# EAGLE design 0251 (EAGLE 7.2.0)
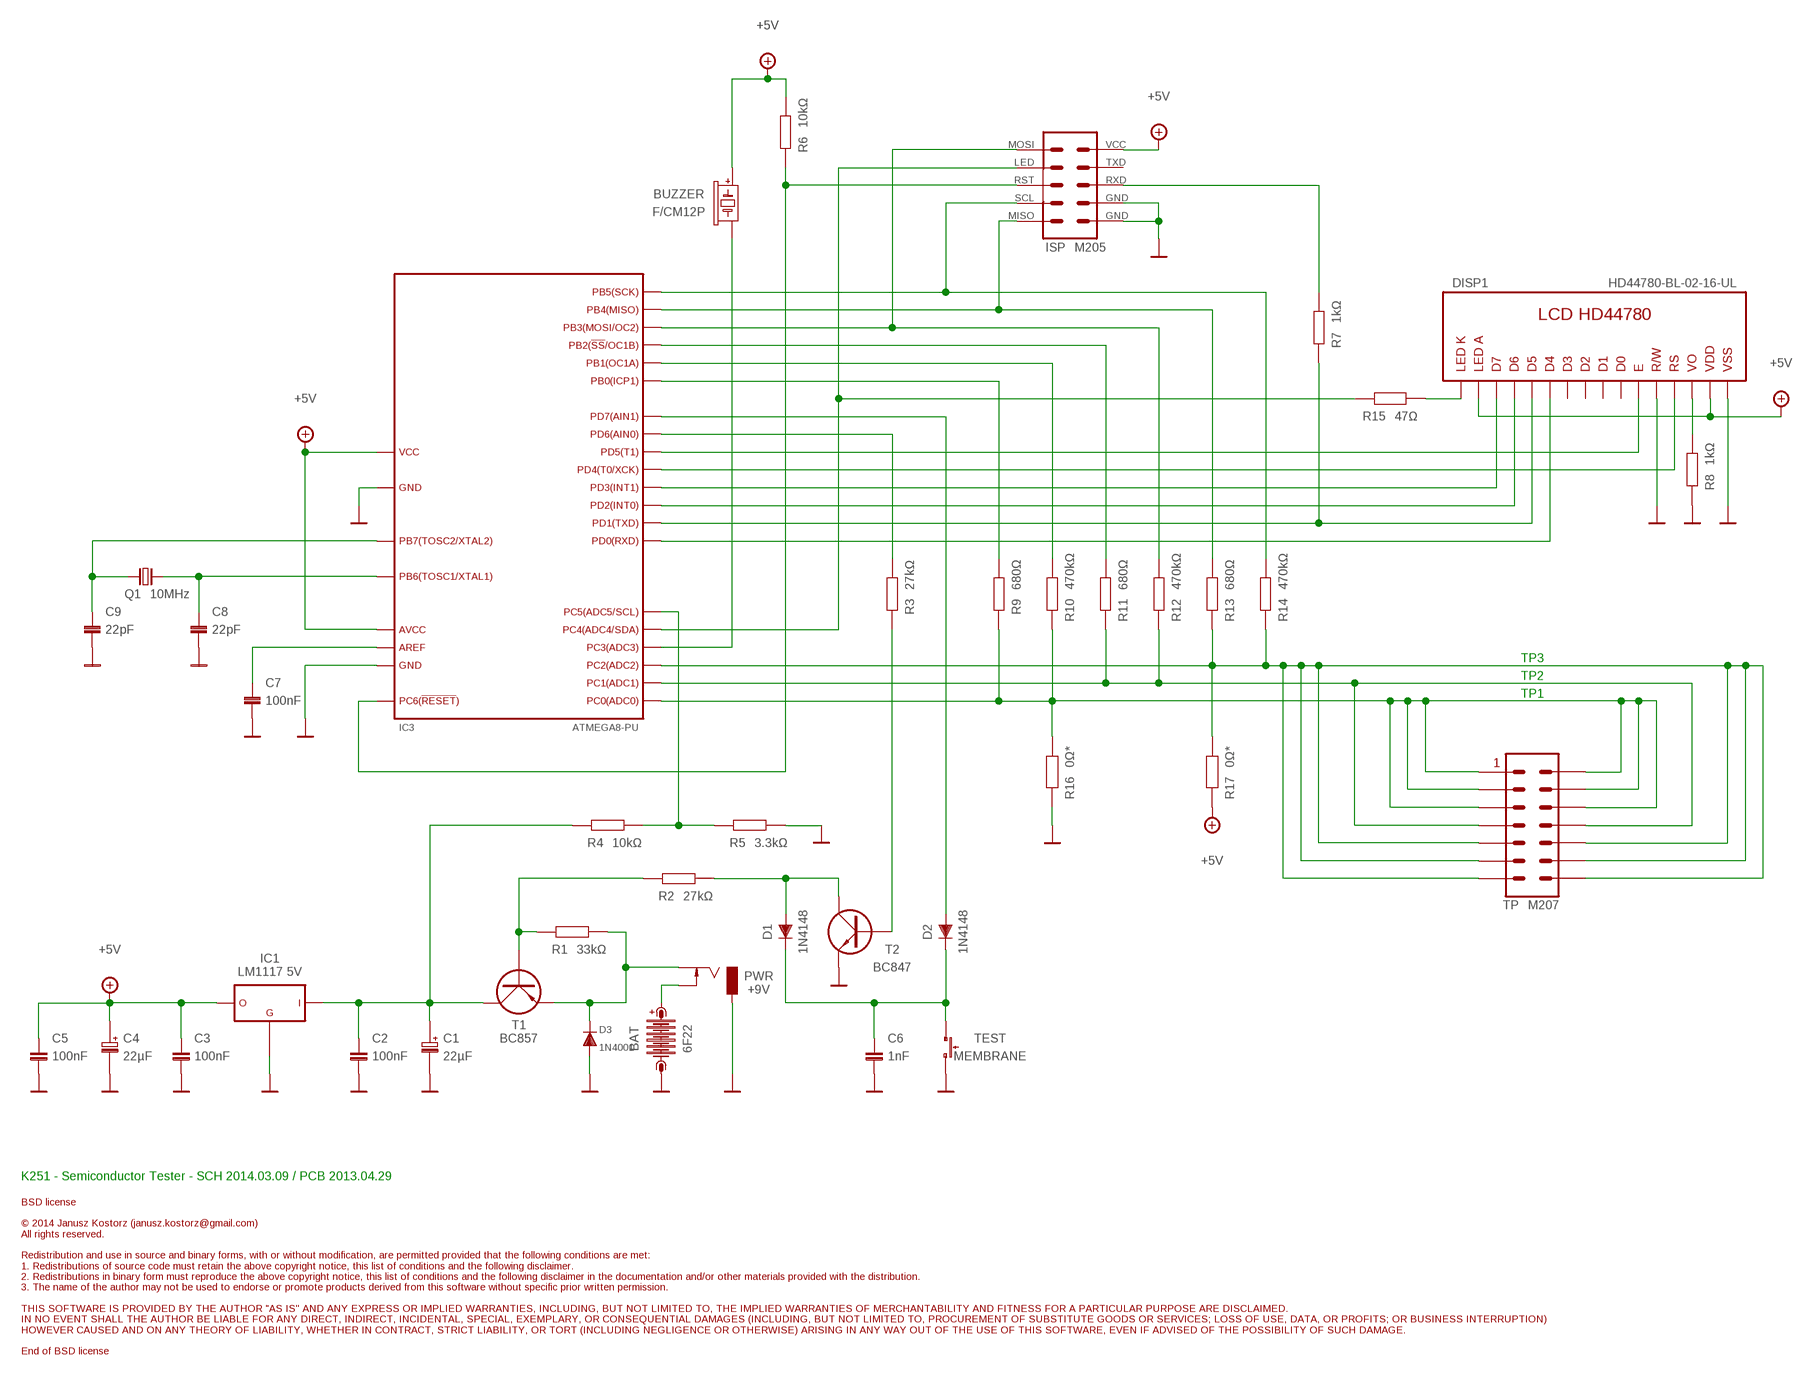
[diagram p0: schematic, sheet 1]

## Parts
BAT  6F22  AB9V  [AB9V]
BUZZER  F/CM12P  BUZZER_F/CM12P  [BUZZER_F/CM12P]
C1  22µF  FM1A101  [E-050-110-020-05]
C2  100nF  CC1206  [C1206]
C3  100nF  CC1206  [C1206]
C4  22µF  FM1A101  [E-050-110-020-05]
C5  100nF  CC1206  [C1206]
C6  1nF  CC1206  [C1206]
C7  100nF  CC1206  [C1206]
C8  22pF  CC1206  [C1206]
C9  22pF  CC1206  [C1206]
D1  1N4148  1N4148DO35-10  [DO35-10]
D2  1N4148  1N4148DO35-10  [DO35-10]
D3  1N4001  1N4004  [DO41-10]
DISP1  HD44780-BL-02-16-UL  [02-16-UL-BL]
IC1  LM1117 5V  LM1117DTX-5.0  [TO252]
IC3  ATMEGA8-PU  [DIP254P800X550-28B]
ISP  M205  ATMEL-ISP-10-UART-H  [MM-10-H]
PWR  +9V  DCJ0303  [DCJ0303]
Q1  10MHz  CRYSTALHC49S  [HC49/S]
R1  33kΩ  RR1206  [R1206]
R2  27kΩ  RR1206  [R1206]
R3  27kΩ  RR1206  [R1206]
R4  10kΩ  RR1206  [R1206]
R5  3.3kΩ  RR1206  [R1206]
R6  10kΩ  RR1206  [R1206]
R7  1kΩ  RR1206  [R1206]
R8  1kΩ  RR1206  [R1206]
R9  680Ω  R0207/12  [0207/12]
R10  470kΩ  R0207/12  [0207/12]
R11  680Ω  R0207/12  [0207/12]
R12  470kΩ  R0207/12  [0207/12]
R13  680Ω  R0207/12  [0207/12]
R14  470kΩ  R0207/12  [0207/12]
R15  47Ω  RR1206  [R1206]
R16  0Ω*  RR1206  [R1206]
R17  0Ω*  RR1206  [R1206]
T1  BC857  BC857ASMD  [SOT23-BEC]
T2  BC847  BC847ASMD  [SOT23-BEC]
TEST  MEMBRANE  10-XX  [B3F-10XX-M]
TP  M207  2-7  [2-7]

## Nets
+5V: BUZZER.+ C3.2 C4.+ C5.2 DISP1.2(VDD) DISP1.15(A) IC1.2(OUT) IC3.7(VCC) IC3.20(AVCC) ISP.P$2(VCC) R6.2 R17.2
GND: BAT.- C1.- C2.1 C3.1 C4.- C5.1 C6.1 C7.1 C8.1 C9.1 D3.A DISP1.1(VSS) DISP1.5(R/W) IC1.1(GND) IC3.8(GND) IC3.22(GND) ISP.P$8(GND) ISP.P$10(GND) PWR.1 R5.1 R8.1 R16.2 T2.E TEST.1(S)
N$1: ISP.P$6(RXD) R7.1
N$2: DISP1.16(K) R15.1
N$3: D3.C PWR.3 R1.2 T1.E
N$4: IC3.12(PD6) R3.2
N$5: C1.+ C2.2 IC1.3(IN) R4.2 T1.C
N$6: C6.2 D1.C D2.C TEST.3(P)
N$7: BAT.+ PWR.2
N$8: D1.A R2.1 T2.C
N$10: IC3.14(PB0) R9.1
N$11: IC3.15(PB1) R10.1
N$12: C7.2 IC3.21(AREF)
N$13: DISP1.3(VO) R8.2
N$14: IC3.16(PB2) R11.1
N$15: IC3.17(PB3) ISP.P$1(MOSI) R12.1
N$16: IC3.28(PC5) R4.1 R5.2
N$17: IC3.18(PB4) ISP.P$9(MISO) R13.1
N$18: IC3.19(PB5) ISP.P$7(SCL) R14.1
N$19: DISP1.11(DB4) IC3.2(PD0)
N$20: DISP1.12(DB5) IC3.3(PD1) R7.2
N$21: DISP1.13(DB6) IC3.4(PD2)
N$23: DISP1.14(DB7) IC3.5(PD3)
N$24: R1.1 R2.2 T1.B
N$25: DISP1.4(RS) IC3.6(PD4)
N$26: DISP1.6(E) IC3.11(PD5)
N$29: D2.A IC3.13(PD7)
N$31: IC3.27(PC4) ISP.P$3(LED) R15.2
N$32: BUZZER.- IC3.26(PC3)
N$36: IC3.1(PC6) ISP.P$5(RST) R6.1
N$37: C9.2 IC3.10(PB7) Q1.1
N$38: C8.2 IC3.9(PB6) Q1.2
T2: R3.1 T2.B
TP1: IC3.23(PC0) R9.2 R10.2 R16.1 TP.1 TP.2 TP.3 TP.4 TP.5 TP.6
TP2: IC3.24(PC1) R11.2 R12.2 TP.7 TP.8
TP3: IC3.25(PC2) R13.2 R14.2 R17.1 TP.9 TP.10 TP.11 TP.12 TP.13 TP.14
Unconnected: DISP1.7(DB0) DISP1.8(DB1) DISP1.9(DB2) DISP1.10(DB3) ISP.P$4(TXD)

## Notes on the sheet
- TP3
- TP2
- TP1
- K251 - Semiconductor Tester - SCH 2014.03.09 / PCB 2013.04.29

## Library data of the parts
BAT = battery:AB9V: 9-V BATTERY CLIP
BUZZER = buzzer:BUZZER_F/CM12P: BUZZER Source: Buerklin
C1 C4 = capacitors-panasonic-fm-a:FM1A101: 100µF / 10V; VALUE: 100µF; VOLTAGE: 10V
C2 C3 C5-C9 = rcl:C
D1 D2 = diodes:1N4148: DIODE high speed (Philips)
D3 = diodes:1N4004: DIODE general purpose rectifier, 1 A
DISP1 = lcd:HD44780-BL
IC1 = vreg:LM1117
IC3 = ic-atmel:ATMEGA8-PU
ISP = con-isp:ATMEL-ISP-10-UART
PWR = con-supply:DCJ0303; OC_FARNELL: unknown; OC_NEWARK: unknown
Q1 = crystal:CRYSTAL
R1-R17 = rcl:R
T1 = transistors:BC857*
T2 = transistors:BC847*
TEST = sw-omron:10-XX: OMRON SWITCH; MPN: B3F-1000; OC_FARNELL: 176432; OC_NEWARK: 36M3542
TP = con-pins:2-7

## Net classes
0 low signal: width 0.305 mm

## Board
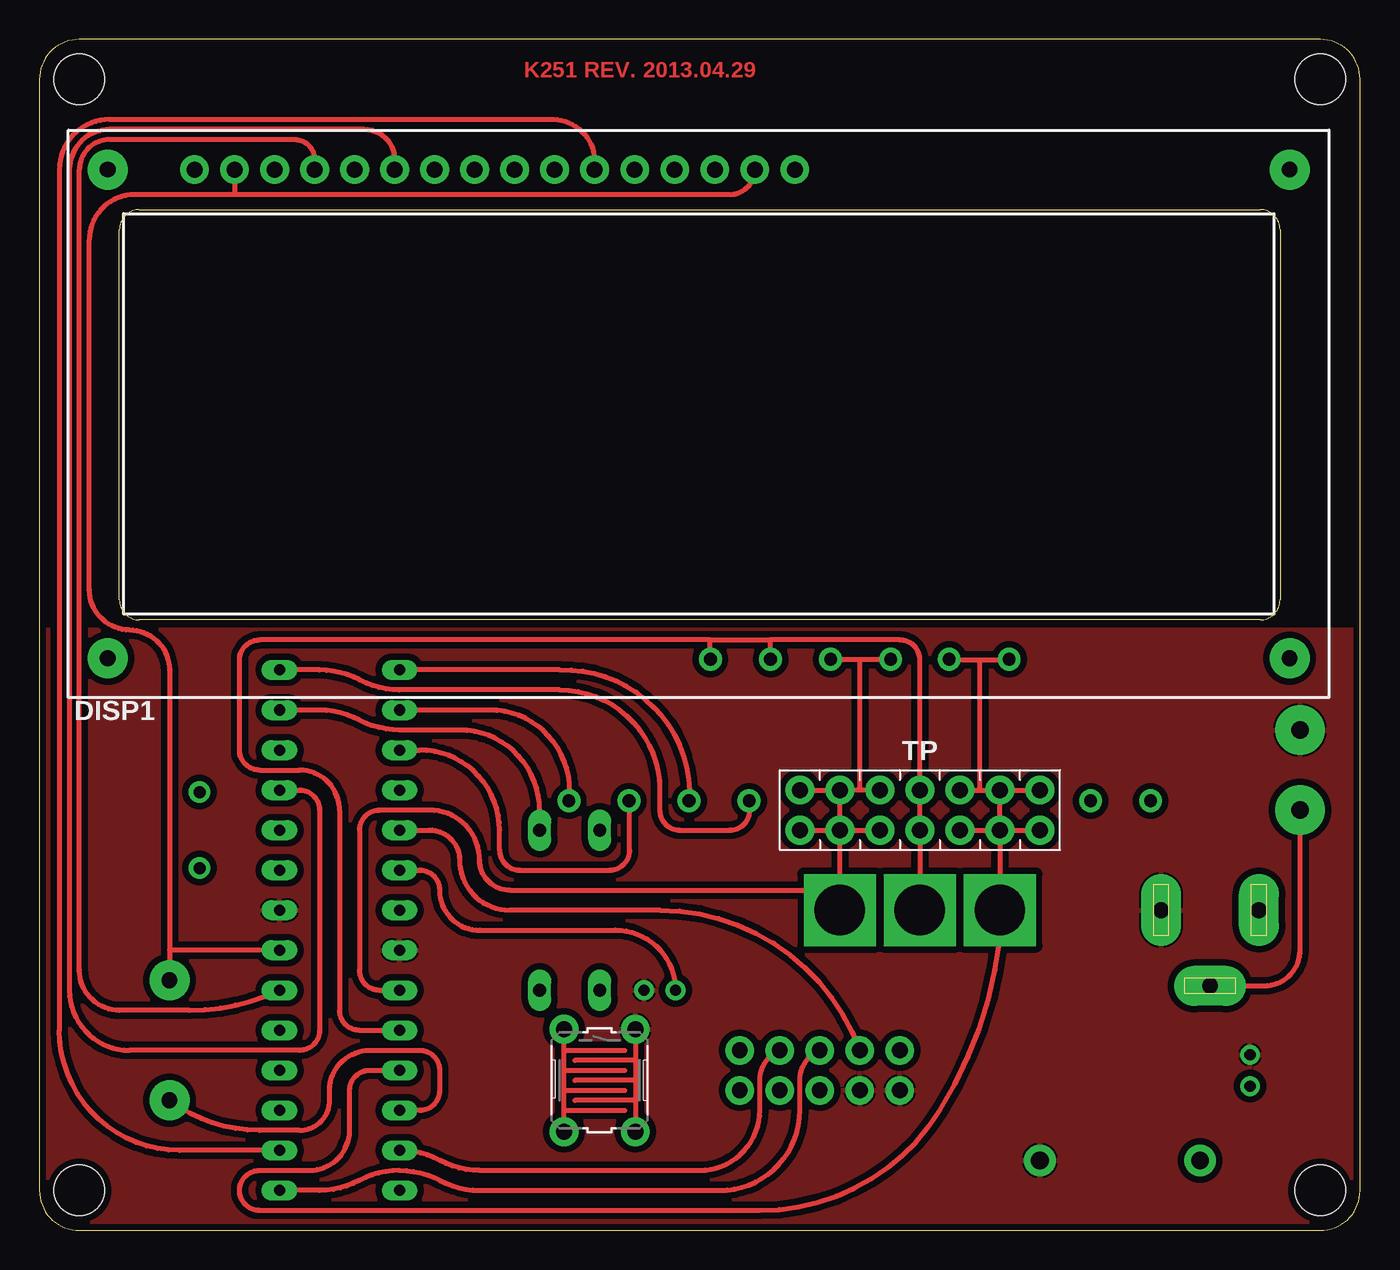
[diagram p1: board, top side]
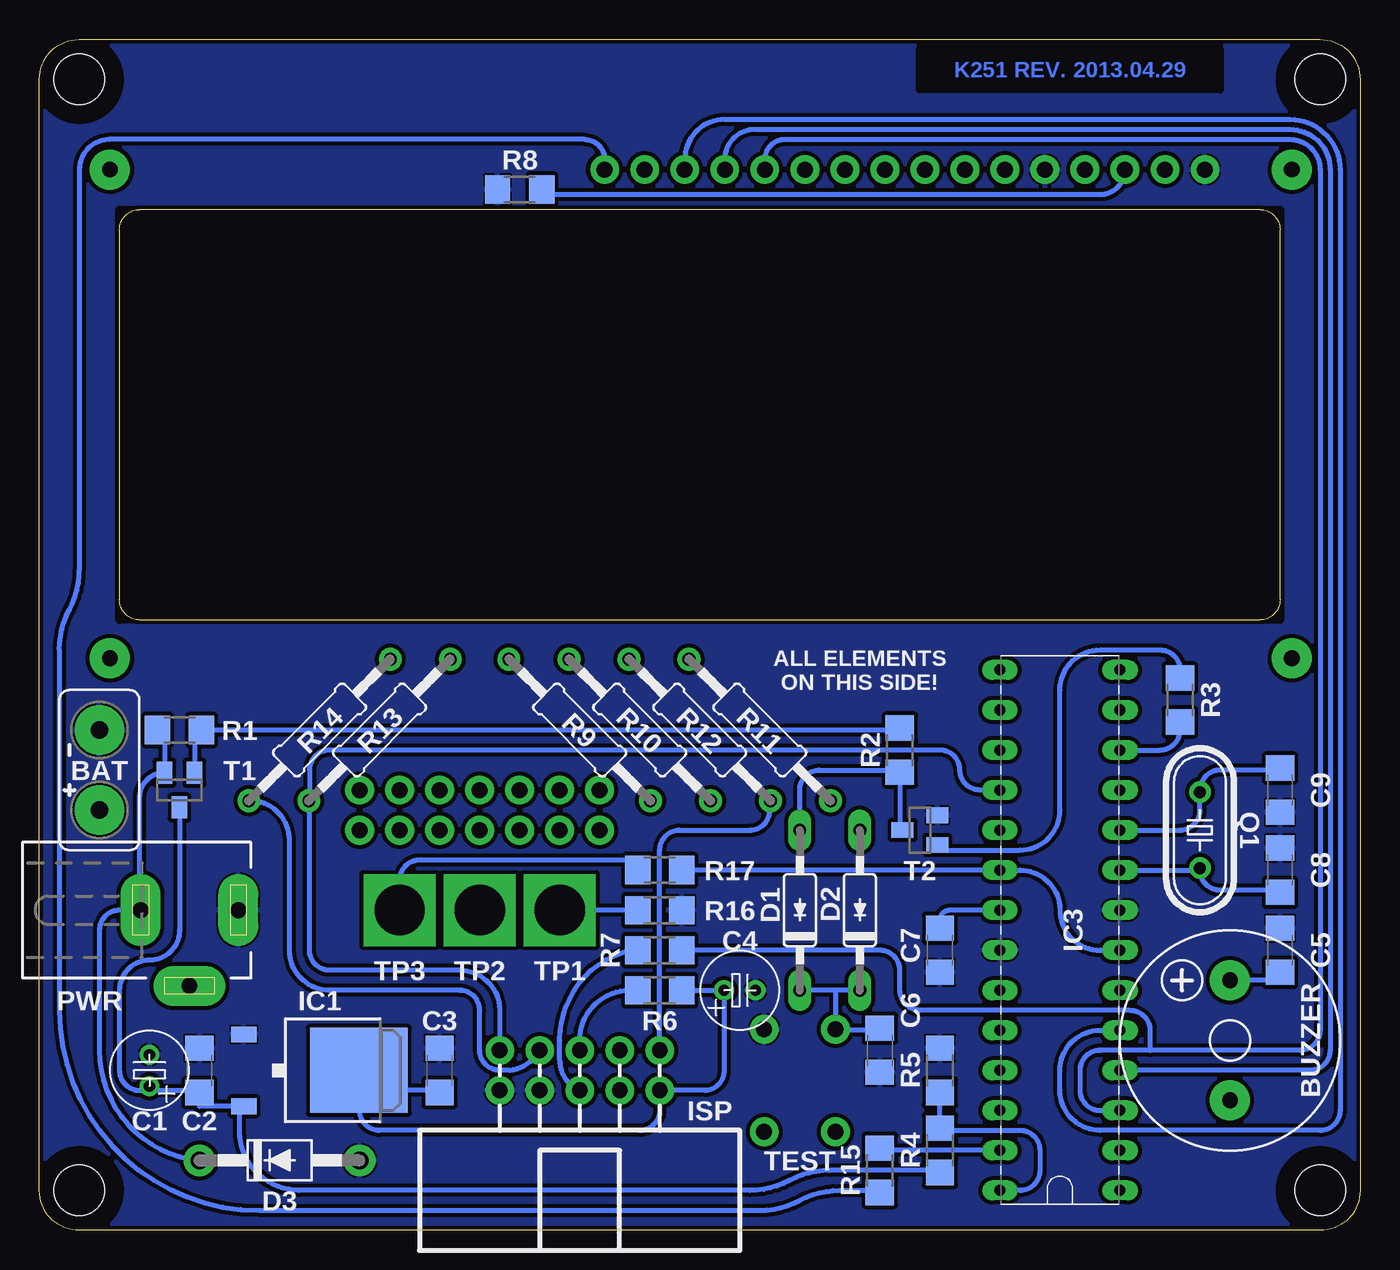
[diagram p2: board, bottom side, seen from below]

Size 83.82 x 75.56 mm. Coordinates in mm from the lower left corner, seen from the top.
Outline: 0,2.54 arc90 2.54,0 81.28,0 arc90 83.82,2.54 83.82,73.03 arc90 81.28,75.56 2.54,75.56 arc90 0,73.03 0,2.54
Outline: 6.35,64.77 77.47,64.77 arc-90 78.74,63.5 78.74,40.01 arc-90 77.47,38.73 6.35,38.73 arc-90 5.08,40.01 5.08,63.5 arc-90 6.35,64.77
Copper layers (1*16): Top 0.035mm / dielectric 1.5mm / Bottom 0.035mm
Design rules "manualmount": minimum track width 10mil, minimum drill 0.3mm, track to track 8mil, track to pad 8mil, pad to pad 8mil, via to via 8mil, smd to smd 8mil, copper to edge 10mil, drill to drill 8mil, minimum pad ring 10mil, minimum via ring 8mil, stop-mask expansion 5mil, vias tented up to drill 0mil, thermal gap 5mil
Holes 3.2 mm at 2.54,2.54 2.54,73.03 81.28,2.54 81.28,73.03
bRestrict: area 5.1,38.7 to 78.7,64.8; area 8.9,72.4 to 27.9,74.9; area 0.4,0.4 to 4.7,4.7; area 79.1,0.4 to 83.4,4.7; area 79.1,70.9 to 83.4,75.2; area 0.4,70.9 to 4.7,75.2

### Footprints (pad centres in the part's own frame; a part is rotated, then mirrored left to right if it is on the bottom)
AB9V = drill 1.118 pad 3.15: + 0,2.54; - 0,-2.54
BUZZER_F/CM12P = drill 1 pad 2.54: + 3.81,0; - -3.81,0
E-050-110-020-05 = drill 0.7: + -1,0; - 1,0
C1206 = smd 1.6 x 1.8: 1 -1.4,0; 2 1.4,0
DO35-10 = drill 0.813 long: A 5.08,0; C -5.08,0
DO41-10 = drill 1.118: A 5.08,0; C -5.08,0
02-16-UL-BL = drill 1.016: 1 0,0; 2 2.54,0; 3 5.08,0; 4 7.62,0; 5 10.16,0; 6 12.7,0; 7 15.24,0; 8 17.78,0; 9 20.32,0; 10 22.86,0; 11 25.4,0; 12 27.94,0; 13 30.48,0; 14 33.02,0; 15 35.56,0; 16 38.1,0 | drill 1 pad 2.54: MLD -5.5,-31; MLU -5.5,0; MRD 69.5,-31; MRU 69.5,0
TO252 = smd 1 x 1.6: 1 -2.28,-4.8; 3 2.28,-4.8 | smd 5.4 x 6.2: 2 0,2.5
DIP254P800X550-28B = drill 0.7 long: 1 -3.81,16.51; 2 -3.81,13.97; 3 -3.81,11.43; 4 -3.81,8.89; 5 -3.81,6.35; 6 -3.81,3.81; 7 -3.81,1.27; 8 -3.81,-1.27; 9 -3.81,-3.81; 10 -3.81,-6.35; 11 -3.81,-8.89; 12 -3.81,-11.43; 13 -3.81,-13.97; 14 -3.81,-16.51; 15 3.81,-16.51; 16 3.81,-13.97; 17 3.81,-11.43; 18 3.81,-8.89; 19 3.81,-6.35; 20 3.81,-3.81; 21 3.81,-1.27; 22 3.81,1.27; 23 3.81,3.81; 24 3.81,6.35; 25 3.81,8.89; 26 3.81,11.43; 27 3.81,13.97; 28 3.81,16.51
MM-10-H = drill 1: P$1 -5.08,-1.27; P$2 -5.08,1.27; P$3 -2.54,-1.27; P$4 -2.54,1.27; P$5 0,-1.27; P$6 0,1.27; P$7 2.54,-1.27; P$8 2.54,1.27; P$9 5.08,-1.27; P$10 5.08,1.27
DCJ0303 = drill 1 pad 2.54 long: 1 0,3.1; 2 4.8,0; 3 0,-3.1
HC49/S = drill 0.762: 1 -2.413,0; 2 2.413,0
R1206 = smd 1.6 x 1.8: 1 -1.4,0; 2 1.4,0
0207/12 = drill 0.8: 1 -6.35,0; 2 6.35,0
SOT23-BEC = smd 1 x 1.4: B -0.95,-1.1; C 0,1.1; E 0.95,-1.1
B3F-10XX-M = drill 1.016: 1 -3.251,2.261; 2 3.251,2.261; 3 -3.251,-2.261; 4 3.251,-2.261
2-7 = drill 1.016: 1 0,0; 2 0,-2.54; 3 2.54,0; 4 2.54,-2.54; 5 5.08,0; 6 5.08,-2.54; 7 7.62,0; 8 7.62,-2.54; 9 10.16,0; 10 10.16,-2.54; 11 12.7,0; 12 12.7,-2.54; 13 15.24,0; 14 15.24,-2.54

### Placement (x,y rotation side)
BAT  80.01,29.21 180 bottom
BUZZER  8.26,12.06 90 bottom
C1  76.83,10.16 90 bottom
C2  73.66,10.16 270 bottom
C3  58.42,10.16 270 bottom
C4  39.37,15.24 0 bottom
C5  5.08,17.78 270 bottom
C6  30.48,11.43 90 bottom
C7  26.67,17.78 90 bottom
C8  5.08,22.86 270 bottom
C9  5.08,27.94 90 bottom
D1  35.56,20.32 90 bottom
D2  31.75,20.32 90 bottom
D3  68.58,4.45 0 bottom
DISP1  9.84,67.31 0 top
IC1  66.04,10.16 270 bottom
IC3  19.05,19.05 180 bottom
ISP  49.53,10.16 180 bottom
PWR  74.3,20.32 270 bottom
Q1  10.16,25.4 270 bottom
R1  74.93,31.75 180 bottom
R2  29.21,30.48 90 bottom
R3  11.43,33.66 270 bottom
R4  26.67,5.08 270 bottom
R5  26.67,10.16 270 bottom
R6  44.45,15.24 0 bottom
R7  44.45,17.78 0 bottom
R8  53.34,66.04 0 bottom
R9  49.53,31.75 135 bottom
R10  45.72,31.75 135 bottom
R11  38.1,31.75 135 bottom
R12  41.91,31.75 135 bottom
R13  62.23,31.75 45 bottom
R14  66.04,31.75 45 bottom
R15  30.48,3.81 90 bottom
R16  44.45,20.32 0 bottom
R17  44.45,22.86 0 bottom
T1  74.93,27.94 180 bottom
T2  27.94,25.4 90 bottom
TEST  35.56,9.53 270 top
TP  48.26,27.94 0 top
U$1  [CE]  67.31,66.99 0 bottom
U$2  [ESD]  14.61,0.32 0 bottom

### Tracks (layer width: path | path; a pad name or v marks a point on that pad's centre or on a via)
+5V
  Top 0.305: 12.38,65.72 43.81,65.72 arc90 DISP1.15 | 12.38,65.72 6.03,65.72 arc90 3.17,62.87 3.17,40.64 arc90 5.71,38.1 arc-90 8.26,35.56 8.26,17.78 | IC3.20 24.13,22.86 arc-90 25.4,21.59 arc90 27.94,19.05 36.56,19.05 arc-90 C4.+ | 8.26,17.78 BUZZER.+ | DISP1.2 12.38,65.72 | IC3.7 8.26,17.78
  Bottom 0.305: IC3.7 16.51,17.78 arc90 19.05,20.32 arc-90 21.59,22.86 IC3.20 42.41,22.86 arc90 R17.2 | C5.2 arc90 5.58,15.88 BUZZER.+ | R6.2 C4.+ 40.37,10.11 arc90 41.59,8.89 ISP.P$2 44.45,7.62 arc90 45.72,6.35 62.23,6.35 arc90 63.5,7.62 63.5,8.89 | 63.5,8.89 63.5,10.12 arc-90 IC1.2 | C3.2 58.42,8.89 63.5,8.89
GND
  pour Bottom (isolate 0.254): 2.54,75.56 81.28,75.56 arc-90 83.82,73.03 83.82,2.54 arc-90 81.28,0 2.54,0 arc-90 0,2.54 0,73.03 arc-90
  pour Top (isolate 0.406): 0,38.1 83.82,38.1 83.82,2.54 arc-90 81.28,0 2.54,0 arc-90 0,2.54
N$1
  Bottom 0.305: ISP.P$6 arc67 50.8,10.79 50.8,12.06 arc76 46.35,17.78 arc29 R7.1
N$2
  Bottom 0.305: 30.63,2.54 30.63,2.41 R15.1 30.48,2.54 33.02,2.54 arc-28 35.56,1.91 arc28 38.1,1.27 69.85,1.27 arc90 82.55,13.97 82.55,36.83 arc28 81.92,39.37 arc-28 81.28,41.91 81.28,67.31 arc90 79.38,69.22 49.21,69.22 arc90 47.94,67.94 DISP1.16
N$3
  Bottom 0.305: R1.2 75.88,31.75 T1.E arc-90 77.47,27.45 77.47,20.32 PWR.3 78.74,20.32 arc-90 80.01,19.05 80.01,11.43 arc-85 D3.C
N$4
  Bottom 0.305: IC3.12 12.7,30.48 arc-90 11.43,31.75 R3.2
N$5
  Bottom 0.305: R4.2 26.82,3.68 26.82,3.81 33.66,3.81 arc-28 36.2,3.17 arc28 38.73,2.54 67.31,2.54 arc90 71.12,6.35 71.12,7.88 IC1.3 | 74.93,27.35 74.93,27.3 74.93,26.92 T1.C 74.93,19.05 arc90 76.83,17.14 arc-90 78.74,15.24 78.74,10.16 arc-90 77.47,8.89 76.83,8.89 | 70.61,7.88 IC1.3 | IC1.3 73.66,7.88 C2.2 arc-90 73.79,8.89 76.83,8.89 | C1.+ 76.83,8.89
N$6
  Bottom 0.305: 33.3,15.24 TEST.3 33.3,12.7 30.48,12.7 C6.2 | D2.C 33.3,15.24 | 33.3,15.24 D1.C
N$7
  Top 0.305: PWR.2 77.75,15.52 arc90 80.01,17.78 BAT.+
N$8
  Bottom 0.305: T2.C 29.21,25.4 R2.1 arc-90 29.34,29.21 34.29,29.21 arc-90 35.56,27.94 D1.A
N$10
  Top 0.305: IC3.14 17.78,35.56 arc-28 20.32,34.92 arc28 22.86,34.29 33.02,34.29 arc-90 39.37,27.94 39.37,26.67 arc90 40.64,25.4 43.81,25.4 arc90 45.09,26.67 45.09,27.21 arc90 R9.1
N$11
  Top 0.305: R10.1 41.27,27.3 41.27,27.94 arc90 33.02,35.56 IC3.15
N$12
  Bottom 0.305: IC3.21 26.04,20.32 arc-90 26.67,19.68 C7.2
N$13
  Bottom 0.305: R8.2 52.07,66.04 52.07,65.72 16.51,65.72 arc-90 DISP1.3
N$14
  Top 0.305: IC3.16 28.57,33.02 arc-90 33.66,27.94 33.66,27.3 R11.1
N$15
  Top 0.305: IC3.17 24.13,30.48 arc-90 29.21,25.4 29.21,24.13 arc90 30.48,22.86 36.2,22.86 arc90 37.47,24.13 37.47,27.26 R12.1
  Bottom 0.305: ISP.P$1 44.45,24.13 arc90 43.18,25.4 38.73,25.4 arc-90 37.47,26.67 37.47,27.21 | 37.47,27.26 R12.1 | 37.47,27.21 arc90 R12.1 | 37.47,27.3 arc-90 R12.1 | 37.47,27.21 arc90 R12.1
N$16
  Bottom 0.305: R4.1 R5.2 | 26.67,6.35 21.59,6.35 arc90 20.32,5.08 20.32,3.81 arc90 21.59,2.54 IC3.28
  Bottom 0.406: R4.1 26.67,6.35
N$17
  Bottom 0.305: IC3.18 24.13,27.94 arc90 25.4,29.21 arc-90 26.67,30.48 65.41,30.48 arc-90 66.67,29.21 66.67,27.3 arc90 R13.1 arc90 66.67,27.21 66.67,17.78 arc-90 65.41,16.51 57.15,16.51 arc90 54.61,13.97 ISP.P$9
N$18
  Top 0.305: IC3.19 24.77,25.4 arc-90 26.67,23.5 arc90 29.84,20.32 39.37,20.32 arc-70 ISP.P$7
  Bottom 0.305: ISP.P$7 arc53 53.98,10.16 54.61,10.16 arc90 55.88,11.43 55.88,13.97 arc-90 57.15,15.24 65.41,15.24 arc90 67.94,17.78 67.94,24.77 arc-90 70.44,27.26 R14.1
N$19
  Top 0.305: DISP1.11 35.24,67.94 arc90 32.38,70.48 4.45,70.48 arc90 1.27,67.31 1.27,12.7 arc90 8.89,5.08 IC3.2
N$20
  Bottom 0.305: 13.34,11.43 3.81,11.43 arc-90 2.54,12.7 2.54,67.31 arc-90 4.45,69.22 36.51,69.22 arc-90 37.79,67.94 DISP1.12 | 13.34,11.43 16.51,11.43 arc-90 17.78,10.16 17.78,8.89 arc-90 16.51,7.62 IC3.3 | 13.34,11.43 13.34,12.7 arc-90 14.61,13.97 27.94,13.97 arc90 29.21,15.24 29.21,16.51 arc-90 30.48,17.78 R7.2
N$21
  Bottom 0.305: DISP1.13 40.33,67.94 arc90 38.42,69.85 4.45,69.85 arc90 1.91,67.31 1.91,11.43 arc90 3.17,10.16 IC3.4
N$23
  Bottom 0.305: IC3.5 16.51,12.7 arc-90 19.05,10.16 19.05,8.89 arc-90 16.51,6.35 2.54,6.35 arc-90 1.27,7.62 1.27,67.31 arc-90 4.45,70.48 40.32,70.48 arc-90 42.87,67.94 DISP1.14
N$24
  Bottom 0.305: R2.2 29.21,31.75 R1.1 73.98,31.75 T1.B
N$25
  Top 0.305: DISP1.4 17.46,67.94 arc90 16.19,69.22 4.45,69.22 arc90 2.54,67.31 2.54,16.51 arc90 5.08,13.97 9.53,13.97 arc25 IC3.6
N$26
  Top 0.305: IC3.11 16.51,27.94 arc-90 17.78,26.67 17.78,12.7 arc-90 16.51,11.43 5.71,11.43 arc-90 1.91,15.24 1.91,67.31 arc-90 4.45,69.85 20.64,69.85 arc-90 22.54,67.94 DISP1.6
N$29
  Top 0.305: D2.A 31.75,26.67 arc90 26.67,31.75 22.86,31.75 arc-28 20.32,32.38 arc28 17.78,33.02 IC3.13
N$31
  Top 0.305: ISP.P$3 arc67 45.72,9.53 45.72,7.62 arc-90 41.91,3.81 27.94,3.81 arc-28 25.4,4.45 arc28 IC3.27
  Bottom 0.305: IC3.27 30.48,5.08 R15.2
N$32
  Top 0.305: IC3.26 24.13,7.62 arc90 25.4,8.89 25.4,10.16 arc90 24.13,11.43 20.95,11.43 arc90 18.41,8.89 18.41,8.26 arc-90 16.51,6.35 13.97,6.35 arc-37 BUZZER.-
N$36
  Top 0.305: IC3.1 17.78,2.54 arc28 20.32,3.17 arc-28 22.86,3.81 arc-28 25.4,3.17 arc28 27.94,2.54 43.18,2.54 arc90 48.26,7.62 48.26,9.53 arc-67 ISP.P$5
  Bottom 0.305: ISP.P$5 49.53,12.06 arc90 46.35,15.24 R6.1
N$37
  Bottom 0.305: IC3.10 11.43,25.4 arc-90 10.16,26.67 Q1.1 10.16,27.94 arc90 8.89,29.21 5.08,29.21 C9.2
N$38
  Bottom 0.305: IC3.9 10.16,22.86 | 10.16,22.86 arc-90 8.89,21.59 5.08,21.59 C8.2 | 10.16,22.86 Q1.2
T2
  Bottom 0.305: R3.1 11.43,35.56 arc-90 12.7,36.83 16.51,36.83 arc-90 19.05,34.29 19.05,26.67 arc90 21.59,24.13 26.84,24.13 T2.B
TP1  (via drill 3.2 pad 4.57)
  Top 0.305: TP.1 TP.3 | TP.2 TP.4 | TP.4 TP.6 | 52.07,36.2 54.02,36.2 R9.2 | 52.07,36.2 50.26,36.2 arc-90 R10.2 | IC3.23 21.59,15.24 arc-90 20.32,16.51 20.32,25.4 arc-90 21.59,26.67 24.77,26.67 arc-90 27.94,23.5 arc90 29.84,21.59 48.9,21.59 48.9,22.23 50.8,22.23 | TP.3 arc90 50.84,27.98 | TP.5 52.07,27.94 | 52.07,27.94 52.07,36.2 | 52.07,27.94 TP.3 | TP.4 TP.3 | 50.8,22.23 TP.4 | v50.8,20.32 50.8,22.23
  Bottom 0.305: R16.1 v50.8,20.32
TP2  (via drill 3.2 pad 4.57)
  Top 0.305: v55.88,20.32 TP.8 TP.7 55.88,36.2 arc90 54.61,37.47 46.35,37.47 | 46.35,37.47 46.35,36.28 R12.2 | R11.2 42.55,36.2 42.55,37.47 | 42.55,37.47 46.35,37.47 | 42.55,37.47 13.97,37.47 arc90 12.7,36.2 12.7,30.48 arc90 13.97,29.21 16.51,29.21 arc-90 19.05,26.67 19.05,13.97 arc90 20.32,12.7 IC3.24
TP3  (via drill 3.2 pad 4.57)
  Top 0.305: TP.10 TP.12 | TP.12 TP.14 | TP.12 TP.11 | TP.11 TP.13 | 61.59,36.2 R14.2 61.51,36.2 59.69,36.2 | R13.2 57.78,36.2 59.69,36.2 | IC3.25 20.95,10.16 arc90 19.68,8.89 19.68,6.35 arc-90 17.14,3.81 13.97,3.81 arc90 12.7,2.54 arc90 13.97,1.27 45.72,1.27 arc58 57.15,7.62 arc25 60.96,18.41 62.87,18.41 62.87,22.23 60.96,22.23 | TP.12 60.96,22.23 | 60.96,22.23 v60.96,20.32 | TP.9 59.69,27.94 | 59.69,27.94 59.69,36.2 | 59.69,27.94 TP.11
  Bottom 0.305: R17.1 45.72,22.99 45.72,23.5 59.69,23.5 arc-90 60.96,22.23 v60.96,20.32

### Text on the board
Top: K251 REV. 2013.04.29
Bottom: K251 REV. 2013.04.29
bNames: ALL ELEMENTS / ON THIS SIDE! | TP1 | TP2 | TP3
tStop: K251 REV. 2013.04.29
bStop: K251 REV. 2013.04.29